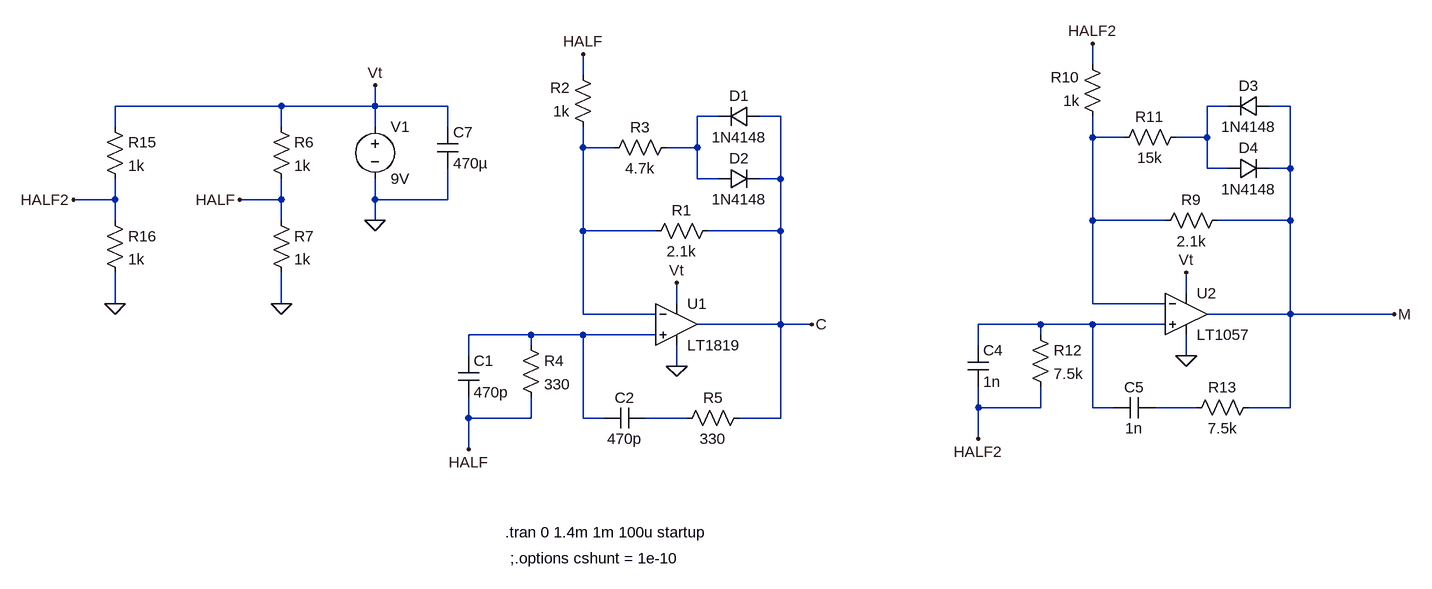
[diagram p0: schematic am-signal-generator.asc]
am-signal-generator.asc, the LTspice schematic file:
Version 4
SHEET 1 2856 680
WIRE 848 -240 848 -272
WIRE 64 -224 64 -256
WIRE -400 -176 -656 -176
WIRE -256 -176 -256 -208
WIRE -256 -176 -400 -176
WIRE -144 -176 -256 -176
WIRE 1056 -176 1024 -176
WIRE 1152 -176 1120 -176
WIRE 272 -160 240 -160
WIRE 368 -160 336 -160
WIRE -656 -144 -656 -176
WIRE -400 -144 -400 -176
WIRE -256 -144 -256 -176
WIRE -144 -144 -144 -176
WIRE 848 -128 848 -160
WIRE 896 -128 848 -128
WIRE 1024 -128 1024 -176
WIRE 1024 -128 976 -128
WIRE 64 -112 64 -144
WIRE 112 -112 64 -112
WIRE 240 -112 240 -160
WIRE 240 -112 192 -112
WIRE 1024 -80 1024 -128
WIRE 1056 -80 1024 -80
WIRE 1152 -80 1152 -176
WIRE 1152 -80 1120 -80
WIRE 240 -64 240 -112
WIRE 272 -64 240 -64
WIRE 368 -64 368 -160
WIRE 368 -64 336 -64
WIRE -656 -32 -656 -64
WIRE -656 -32 -720 -32
WIRE -400 -32 -400 -64
WIRE -400 -32 -464 -32
WIRE -256 -32 -256 -64
WIRE -144 -32 -144 -80
WIRE -144 -32 -256 -32
WIRE -656 0 -656 -32
WIRE -400 0 -400 -32
WIRE -256 0 -256 -32
WIRE 848 0 848 -128
WIRE 960 0 848 0
WIRE 1152 0 1152 -80
WIRE 1152 0 1040 0
WIRE 64 16 64 -112
WIRE 176 16 64 16
WIRE 368 16 368 -64
WIRE 368 16 256 16
WIRE 992 112 992 80
WIRE -656 128 -656 80
WIRE -400 128 -400 80
WIRE 208 128 208 96
WIRE 848 128 848 0
WIRE 960 128 848 128
WIRE 64 144 64 16
WIRE 176 144 64 144
WIRE 1152 144 1152 0
WIRE 1152 144 1024 144
WIRE 1312 144 1152 144
WIRE 368 160 368 16
WIRE 368 160 240 160
WIRE 416 160 368 160
WIRE 768 160 672 160
WIRE 848 160 768 160
WIRE 960 160 848 160
WIRE -16 176 -112 176
WIRE 64 176 -16 176
WIRE 176 176 64 176
WIRE 768 176 768 160
WIRE -16 192 -16 176
WIRE 672 192 672 160
WIRE -112 208 -112 176
WIRE 992 208 992 176
WIRE 208 224 208 192
WIRE 672 288 672 256
WIRE 768 288 768 256
WIRE 768 288 672 288
WIRE 848 288 848 160
WIRE 880 288 848 288
WIRE 1008 288 944 288
WIRE 1152 288 1152 144
WIRE 1152 288 1088 288
WIRE -112 304 -112 272
WIRE -16 304 -16 272
WIRE -16 304 -112 304
WIRE 64 304 64 176
WIRE 96 304 64 304
WIRE 224 304 160 304
WIRE 368 304 368 160
WIRE 368 304 304 304
WIRE 672 336 672 288
WIRE -112 352 -112 304
FLAG -256 0 0
FLAG -256 -208 Vt
FLAG 208 96 Vt
FLAG 208 224 0
FLAG -400 128 0
FLAG -464 -32 HALF
FLAG -112 352 HALF
FLAG 64 -256 HALF
FLAG 992 80 Vt
FLAG 992 208 0
FLAG 672 336 HALF2
FLAG 848 -272 HALF2
FLAG -656 128 0
FLAG -720 -32 HALF2
FLAG 416 160 C
FLAG 1312 144 M
SYMBOL voltage -256 -160 R0
SYMATTR InstName V1
SYMATTR Value 9V
SYMBOL res 272 0 R90
WINDOW 0 0 56 VBottom 2
WINDOW 3 32 56 VTop 2
SYMATTR InstName R1
SYMATTR Value 2.1k
SYMBOL res 80 -128 R180
WINDOW 0 36 76 Left 2
WINDOW 3 36 40 Left 2
SYMATTR InstName R2
SYMATTR Value 1k
SYMBOL res 208 -128 R90
WINDOW 0 0 56 VBottom 2
WINDOW 3 32 56 VTop 2
SYMATTR InstName R3
SYMATTR Value 4.7k
SYMBOL diode 336 -176 R90
WINDOW 0 0 32 VBottom 2
WINDOW 3 32 32 VTop 2
SYMATTR InstName D1
SYMATTR Value 1N4148
SYMBOL diode 272 -48 R270
WINDOW 0 32 32 VTop 2
WINDOW 3 0 32 VBottom 2
SYMATTR InstName D2
SYMATTR Value 1N4148
SYMBOL cap -128 208 R0
SYMATTR InstName C1
SYMATTR Value 470p
SYMBOL res -32 176 R0
SYMATTR InstName R4
SYMATTR Value 330
SYMBOL cap 160 288 R90
WINDOW 0 0 32 VBottom 2
WINDOW 3 32 32 VTop 2
SYMATTR InstName C2
SYMATTR Value 470p
SYMBOL res 320 288 R90
WINDOW 0 0 56 VBottom 2
WINDOW 3 32 56 VTop 2
SYMATTR InstName R5
SYMATTR Value 330
SYMBOL res -416 -160 R0
SYMATTR InstName R6
SYMATTR Value 1k
SYMBOL res -416 -16 R0
SYMATTR InstName R7
SYMATTR Value 1k
SYMBOL res 1056 -16 R90
WINDOW 0 0 56 VBottom 2
WINDOW 3 32 56 VTop 2
SYMATTR InstName R9
SYMATTR Value 2.1k
SYMBOL res 864 -144 R180
WINDOW 0 36 76 Left 2
WINDOW 3 36 40 Left 2
SYMATTR InstName R10
SYMATTR Value 1k
SYMBOL res 992 -144 R90
WINDOW 0 0 56 VBottom 2
WINDOW 3 32 56 VTop 2
SYMATTR InstName R11
SYMATTR Value 15k
SYMBOL diode 1120 -192 R90
WINDOW 0 0 32 VBottom 2
WINDOW 3 32 32 VTop 2
SYMATTR InstName D3
SYMATTR Value 1N4148
SYMBOL diode 1056 -64 R270
WINDOW 0 32 32 VTop 2
WINDOW 3 0 32 VBottom 2
SYMATTR InstName D4
SYMATTR Value 1N4148
SYMBOL cap 656 192 R0
SYMATTR InstName C4
SYMATTR Value 1n
SYMBOL res 752 160 R0
SYMATTR InstName R12
SYMATTR Value 7.5k
SYMBOL cap 944 272 R90
WINDOW 0 0 32 VBottom 2
WINDOW 3 32 32 VTop 2
SYMATTR InstName C5
SYMATTR Value 1n
SYMBOL res 1104 272 R90
WINDOW 0 0 56 VBottom 2
WINDOW 3 32 56 VTop 2
SYMATTR InstName R13
SYMATTR Value 7.5k
SYMBOL cap -160 -144 R0
SYMATTR InstName C7
SYMATTR Value 470µ
SYMBOL res -672 -160 R0
SYMATTR InstName R15
SYMATTR Value 1k
SYMBOL res -672 -16 R0
SYMATTR InstName R16
SYMATTR Value 1k
SYMBOL OpAmps\\LT1057 992 80 R0
SYMATTR InstName U2
SYMBOL OpAmps\\LT1819 208 160 R0
SYMATTR InstName U1
TEXT -56 480 Left 2 !.tran 0 1.4m 1m 100u startup
TEXT -48 520 Left 2 !;.options cshunt = 1e-10

The netlist it stands for:
* am-signal-generator.asc
V1 Vt 0 9V
R1 C N004 2.1k
R2 N004 HALF 1k
R3 N002 N004 4.7k
D1 C N002 1N4148
D2 N002 C 1N4148
C1 N006 HALF 470p
R4 N006 HALF 330
C2 N008 N006 470p
R5 C N008 330
R6 Vt HALF 1k
R7 HALF 0 1k
R9 M N003 2.1k
R10 N003 HALF2 1k
R11 N001 N003 15k
D3 M N001 1N4148
D4 N001 M 1N4148
C4 N005 HALF2 1n
R12 N005 HALF2 7.5k
C5 N007 N005 1n
R13 M N007 7.5k
C7 Vt 0 470µ
R15 Vt HALF2 1k
R16 HALF2 0 1k
XU2 N005 N003 Vt 0 M LT1057  ; pins In+ In- V+ V- OUT
* U1: LT1819 (symbol OpAmps\LT1819 not available, pins judged from their places): In+=N006 In-=N004 V+=Vt V-=0 OUT=C
.model D D
.lib standard.dio
.tran 0 1.4m 1m 100u startup
;.options cshunt = 1e-10
.lib LTC.lib
.backanno
.end